# Altium schematic sheet ESP.SchDoc
size A4; SheetNumber: 3; SheetTotal: 8
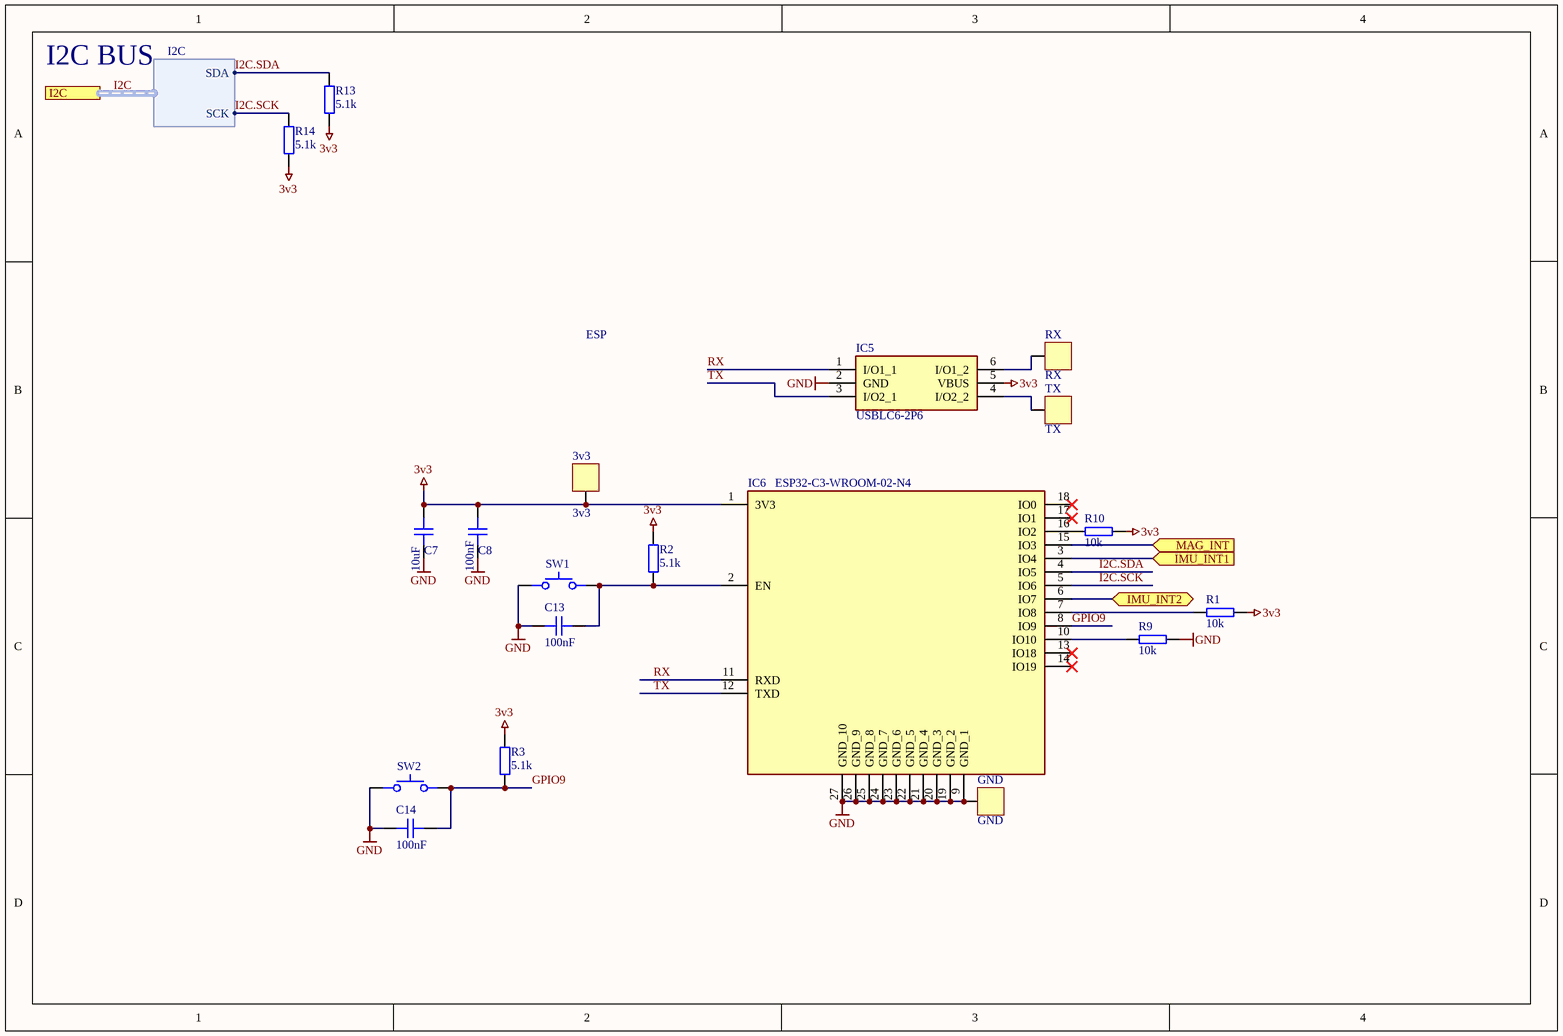
[diagram p0: ESP.SchDoc]

## Parts
3v3  3v3  [PAD_SQ_2MM]  (no BOM)
C7  value 10uF  [CAP_0402]  (hidden comment: C0402_10V)
C8  value 100nF  [CAP_0402]  (hidden comment: C0402_10V)
C13  value 100nF  [CAP_0402]  (hidden comment: C0402_10V)
C14  value 100nF  [CAP_0402]  (hidden comment: C0402_10V)
GND  GND  [PAD_SQ_2MM]  (no BOM)
IC5  USBLC6-2P6  [USBLC62P6]
IC6  ESP32-C3-WROOM-02-N4  [ESP32C3WROOM02N4]
R1  value 10k  [RES 0402/1005]  (hidden comment: Resistor)
R2  value 5.1k  [RES_0402]  (hidden comment: R0402)
R3  value 5.1k  [RES_0402]  (hidden comment: R0402)
R9  value 10k  [RES 0402/1005]  (hidden comment: Resistor)
R10  value 10k  [RES 0402/1005]  (hidden comment: Resistor)
R13  value 5.1k  [RES_0402]  (hidden comment: R0402)
R14  value 5.1k  [RES_0402]  (hidden comment: R0402)
RX  RX  [PAD_SQ_2MM]  (no BOM)
SW1  SKRPANE010  [SKRPANE010]  (value not drawn)
SW2  SKRPANE010  [SKRPANE010]  (value not drawn)
TX  TX  [PAD_SQ_2MM]  (no BOM)

## Ports
I2C (harness I2C, see Top Level Organization[3A], IMU[1A], MAG[1A]), IMU_INT1 (in, see Top Level Organization[3B], IMU[3B]), IMU_INT2 (bidir, see Top Level Organization[3B], IMU[3B]), MAG_INT (in, see Top Level Organization[3C], MAG[2B])

## Harnesses
I2C: SDA, SCK

## Nets
3v3: 3v3.1 C7.2 C8.2 IC5.5(VBUS) IC6.1(3V3) R1.2 R2.2 R3.2 R10.2 R13.2 R14.2
GND: C7.1 C8.1 C13.2 C14.2 GND.1 IC5.2(GND) IC6.9(GND_1) IC6.19(GND_2) IC6.20(GND_3) IC6.21(GND_4) IC6.22(GND_5) IC6.23(GND_6) IC6.24(GND_7) IC6.25(GND_8) IC6.26(GND_9) IC6.27(GND_10) R9.2 SW1.12 SW2.12
GPIO9: C14.1 IC6.8(IO9) R3.1 SW2.34
I2C.SCK: IC6.5(IO6) R14.1 ; port I2C.SCK
I2C.SDA: IC6.4(IO5) R13.1 ; port I2C.SDA
IMU_INT1: IC6.3(IO4) ; port IMU_INT1
IMU_INT2: IC6.6(IO7) ; port IMU_INT2
MAG_INT: IC6.15(IO3) ; port MAG_INT
RX: IC5.1(I/O1_1) IC6.11(RXD)
TX: IC5.3(I/O2_1) IC6.12(TXD)
NetC13_1: C13.1 IC6.2(EN) R2.1 SW1.34
NetIC5_4: IC5.4(I/O2_2) TX.1
NetIC5_6: IC5.6(I/O1_2) RX.1
NetIC6_7: IC6.7(IO8) R1.1
NetIC6_10: IC6.10(IO10) R9.1
NetIC6_16: IC6.16(IO2) R10.1

Not connected (* = marked no-connect by the designer): IC6 13(IO18)* 14(IO19)* 17(IO1)* 18(IO0)*

## Buses and harness runs
harness I2C = port I2C

## Notes on the sheet
- I2C BUS
- ESP

## Library data of the parts
3v3 GND RX TX = PAD_SQ_2MM: Test Point Square 2mm
C7 C8 C13 C14 = CAP_0402_10V: Capacitor SMD 0402 10V
IC5 = USBLC6-2P6: Integrated Circuit; Manufacturer_Name: STMicroelectronics; Datasheet Link: https://datasheet.lcsc.com/szlcsc/STMicroelectronics-USBLC6-2P6_C15999.pdf; Height: 0.6mm; Manufacturer_Part_Number: USBLC6-2P6; Mouser Part Number: 511-USBLC6-2P6; Mouser Price/Stock: https://www.mouser.co.uk/ProductDetail/STMicroelectronics/USBLC6-2P6?qs=6ARB0lp6jlViGcbUSvj1Mw%3D%3D; Arrow Part Number: USBLC6-2P6; Arrow Price/Stock: https://www.arrow.com/en/products/usblc6-2p6/stmicroelectronics?region=nac
IC6 = ESP32-C3-WROOM-02-N4: Multiprotocol Modules SMD module, ESP32-C3, 4MB SPI flash, PCB antenna, -40 C +85 C; Part Name: ESP32-C3-WROOM-02-N4
R1 R9 R10 = CRCW040210K0JNTDBC: RES SMD 10k OHM 5% 1/16W 0402; Manufacturer: Royal Ohm; Power Rating: 63mW, 1/16W; Part Name: CRCW040210K0JNTDBC; Footprint.: 0402; Tolerance: 5%; Temperature Range: -55 ~ 155C; Manufacturer Part Number: CRCW040210K0JNTDBC; Component Link: https://www.tme.eu/pl/details/smd0402-10k/rez; Supplier: TME; Supplier Part Number: CRCW040210K0JNTDBC
R2 R3 R13 R14 = RES_0402: Resistor SMD 0402; Manufacturer: *; Manufacturer Part Number: *; Distributor Link: *
SW1 SW2 = SKRPANE010: Tactile Switch SMD SPST; Manufacturer: Alps Alpine; Manufacturer Part Number: SKRPANE010